# Altium schematic sheet 步进电机控制原理图.SCHDOC
size A4
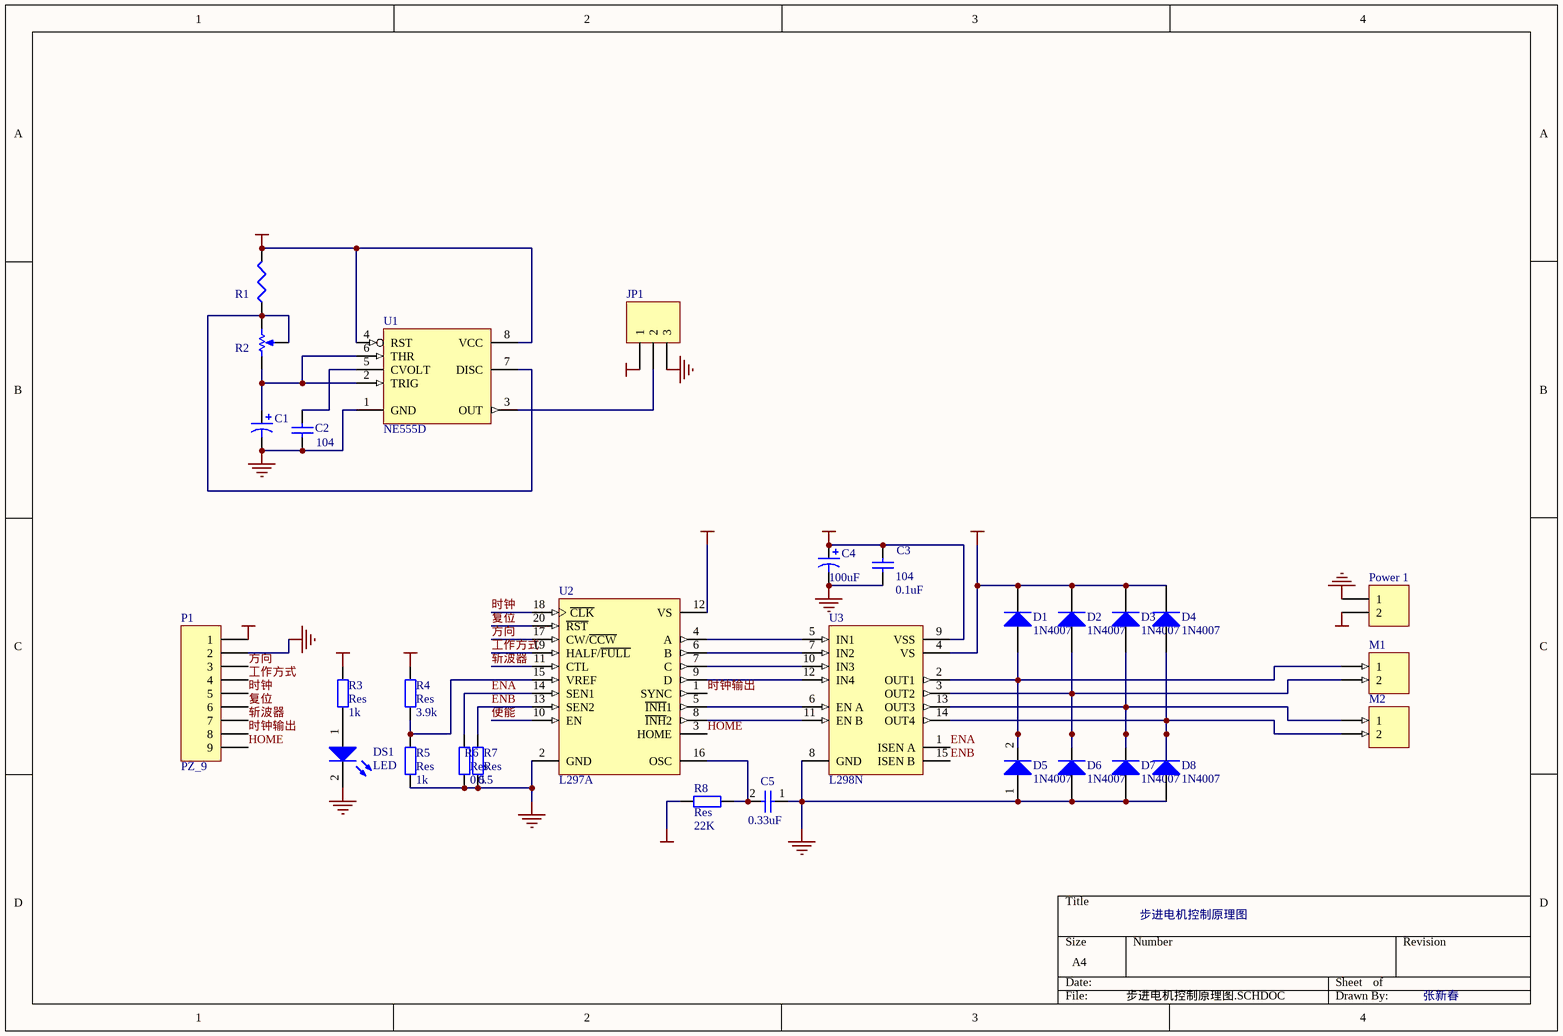
[diagram p0: 步进电机控制原理图.SCHDOC]

## Parts
C1  (no value)  [C-DJ-4]
C2  value 104  [C1608-0603]
C3  104  value 0.1uF  [CPDR]
C4  value 100uF  [C-DJ-6]
C5  value 0.33uF  [C-DJ-4]
D1  1N4007  [D-ZL-10]
D2  1N4007  [D-ZL-10]
D3  1N4007  [D-ZL-10]
D4  1N4007  [D-ZL-10]
D5  1N4007  [D-ZL-10]
D6  1N4007  [D-ZL-10]
D7  1N4007  [D-ZL-10]
D8  1N4007  [D-ZL-10]
DS1  LED  [CPDR]
JP1  (no value)  [HDR1X3]
M1  (no value)  [JK128]
M2  (no value)  [JK128]
P1  PZ_9  [HDR-9]
Power_1  (no value)  [JK128]
R1  (no value)  [C1608-0603]
R2  (no value)  [SIP3-D]
R3  Res  value 1k  [CPDR]
R4  Res  value 3.9k  [CPDR]
R5  Res  value 1k  [CPDR]
R6  Res  value 0.5  [ZCDZl]
R7  Res  value 0.5  [ZCDZl]
R8  Res  value 22K  [CPDR]
U1  NE555D  [CDFP-8]
U2  L297A  [DIP20]
U3  L298N  [L298N]

## Nets
+5V: C3.2 C4.1 P1.1 R3.1 R4.1 R8.2 U2.12(VS) U3.9(VSS)
GND: C1.2 C2.2 C3.1 C4.2 DS1.2(K) JP1.3 P1.2 Power_1.1 R5.2 R6.2 R7.2 U1.1(GND) U2.2(GND)
GND-12: C5.1 D5.1(A) D6.1(A) D7.1(A) D8.1(A) U3.8(GND)
VCC: D1.2(K) D2.2(K) D3.2(K) D4.2(K) JP1.1 Power_1.2 R1.2 U1.4(RST) U1.8(VCC) U3.4(VS)
ENA: R6.1 U2.14(SEN1) U3.1(ISEN_A)
ENB: R7.1 U2.13(SEN2) U3.15(ISEN_B)
HOME: P1.9 U2.3(HOME)
使能: U2.10(EN)
复位: P1.6 U2.20(~{RST})
工作方式: P1.4 U2.19(HALF/~{FULL})
斩波器: P1.7 U2.11(CTL)
方向: P1.3 U2.17(CW/~{CCW})
时钟: P1.5 U2.18(~{CLK})
时钟输出: P1.8 U2.1(SYNC)
NetC1_1: C1.1 R2.1(TOP) U1.2(TRIG) U1.6(THR)
NetC2_1: C2.1 U1.5(CVOLT)
NetC5_2: C5.2 R8.1 U2.16(OSC)
NetD1_1: D1.1(A) D5.2(K) M1.1 U3.2(OUT1)
NetD2_1: D2.1(A) D6.2(K) M1.2 U3.3(OUT2)
NetD3_1: D3.1(A) D7.2(K) M2.1 U3.13(OUT3)
NetD4_1: D4.1(A) D8.2(K) M2.2 U3.14(OUT4)
NetDS1_1: DS1.1(A) R3.2
NetJP1_2: JP1.2 U1.3(OUT)
NetR1_1: R1.1 R2.2(BOT) R2.3(TAP) U1.7(DISC)
NetR4_2: R4.2 R5.1 U2.15(VREF)
NetU2_4: U2.4(A) U3.5(IN1)
NetU2_5: U2.5(~{INH}1) U3.6(EN_A)
NetU2_6: U2.6(B) U3.7(IN2)
NetU2_7: U2.7(C) U3.10(IN3)
NetU2_8: U2.8(~{INH}2) U3.11(EN_B)
NetU2_9: U2.9(D) U3.12(IN4)

## Notes on the sheet
- 步进电机控制原理图
- 张新春

## Library data of the parts
C1 = Cap Pol1: Polarized Capacitor (Radial); Published: 8-Jun-2000; LatestRevisionDate: 17-Jul-2002; LatestRevisionNote: Re-released for DXP Platform.; Publisher: Altium Limited
C2 = Cap Semi: Capacitor (Semiconductor SIM Model); Published: 8-Jun-2000; LatestRevisionDate: 17-Jul-2002; LatestRevisionNote: Re-released for DXP Platform.; PackageReference: C1206; Publisher: Altium Limited
C3 C5 = Cap: Capacitor; Published: 8-Jun-2000; LatestRevisionDate: 17-Jul-2002; LatestRevisionNote: Re-released for DXP Platform.; Publisher: Altium Limited
C4 = Cap Pol3: Polarized Capacitor (Surface Mount); Published: 8-Jun-2000; LatestRevisionDate: 17-Jul-2002; LatestRevisionNote: Re-released for DXP Platform.; PackageReference: C0805; Publisher: Altium Limited
D1-D8 = Diode 1N4007: 1 Amp General Purpose Rectifier; Published: 8-Jun-2000; LatestRevisionDate: 17-Jul-2002; LatestRevisionNote: Re-released for DXP Platform.; DatasheetDocument: 1998; PackageDocument: Aug-1999; PackageReference: DO-41; Publisher: Altium Limited; Code_JEDEC: DO-204-AL
DS1 = LED: 发光二极管; Published: 8-Jun-2000; LatestRevisionDate: 17-Jul-2002; LatestRevisionNote: Re-released for DXP Platform.; Publisher: Altium Limited
JP1 = Header 3: Header, 3-Pin; LatestRevisionDate: 17-Jul-2002; LatestRevisionNote: Re-released for DXP Platform.; Publisher: Altium Limited
M1 M2 Power_1 = MHDR1X2: Header, 2-Pin; LatestRevisionDate: 17-Jul-2002; LatestRevisionNote: Re-released for DXP Platform.; Publisher: Altium Limited
P1 = PZ_9: 排针——9; LatestRevisionDate: 17-Jul-2002; LatestRevisionNote: Re-released for DXP Platform.; Publisher: Altium Limited
R1 = Res3: Resistor; Published: 8-Jun-2000; LatestRevisionDate: 17-Jul-2002; LatestRevisionNote: Re-released for DXP Platform.; Publisher: Altium Limited
R2 = RPot: Potentiometer; Sim Note: Enter the Resistance value and the set point into parameter fields.; Set Position: 0.5; Published: 8-Jun-2000; LatestRevisionDate: 17-Jul-2002; LatestRevisionNote: Re-released for DXP Platform.; Publisher: Altium Limited
R3-R8 = Res: 电阻; Published: 8-Jun-2000; LatestRevisionDate: 17-Jul-2002; LatestRevisionNote: Re-released for DXP Platform.; Publisher: Altium Limited
U1 = NE555D: Precision Timer; Manufacturer: Texas Instruments; Package Information: Latest Revision: Jan-1998; Class I: Analog; Class II: Timer Circuit; Published: 16-Jan-2001; Revision: July-2002: Re-released for DXP Platform.; Datasheet: Latest Revision: Feb-1992; Package Reference: D008; Publisher: Altium Limited
U2 = L297A: Stepper Motor Controller; Published: 8-Jun-2000; LatestRevisionDate: 6-Jun-2005; LatestRevisionNote: Stylized 3D Model Added.; DatasheetDocument: Aug-1996; PackageDocument: Jun-1998; PackageReference: DIP20; Publisher: Altium Limited; Code_JEDEC: MS-015-AE; ComponentLink1Description: Manufacturer Link; ComponentLink1URL: http://www.st.com/
U3 = L298N: Dual Full Bridge Driver; Published: 8-Jun-2000; LatestRevisionDate: 17-Jul-2002; LatestRevisionNote: Re-released for DXP Platform.; DatasheetDocument: Jul-1999; PackageDocument: Apr-1998; PackageReference: Multiwatt15H; Publisher: Altium Limited; ComponentLink1Description: Manufacturer Link; ComponentLink1URL: http://www.st.com/